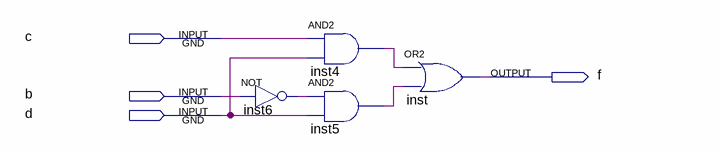
[diagram p0: schematic sheet]
// Quartus schematic 1-5-after.bdf as structural Verilog: 4 symbols, 4 pins
module \1-5-after  (
  input  c,
  input  b,
  input  d,
  output f
);

  wire inst4_out, inst5_out, inst6_out;

  not inst6 (inst6_out, b);
  and inst4 (inst4_out, c, d);
  and inst5 (inst5_out, inst6_out, d);
  or inst (f, inst4_out, inst5_out);
endmodule
